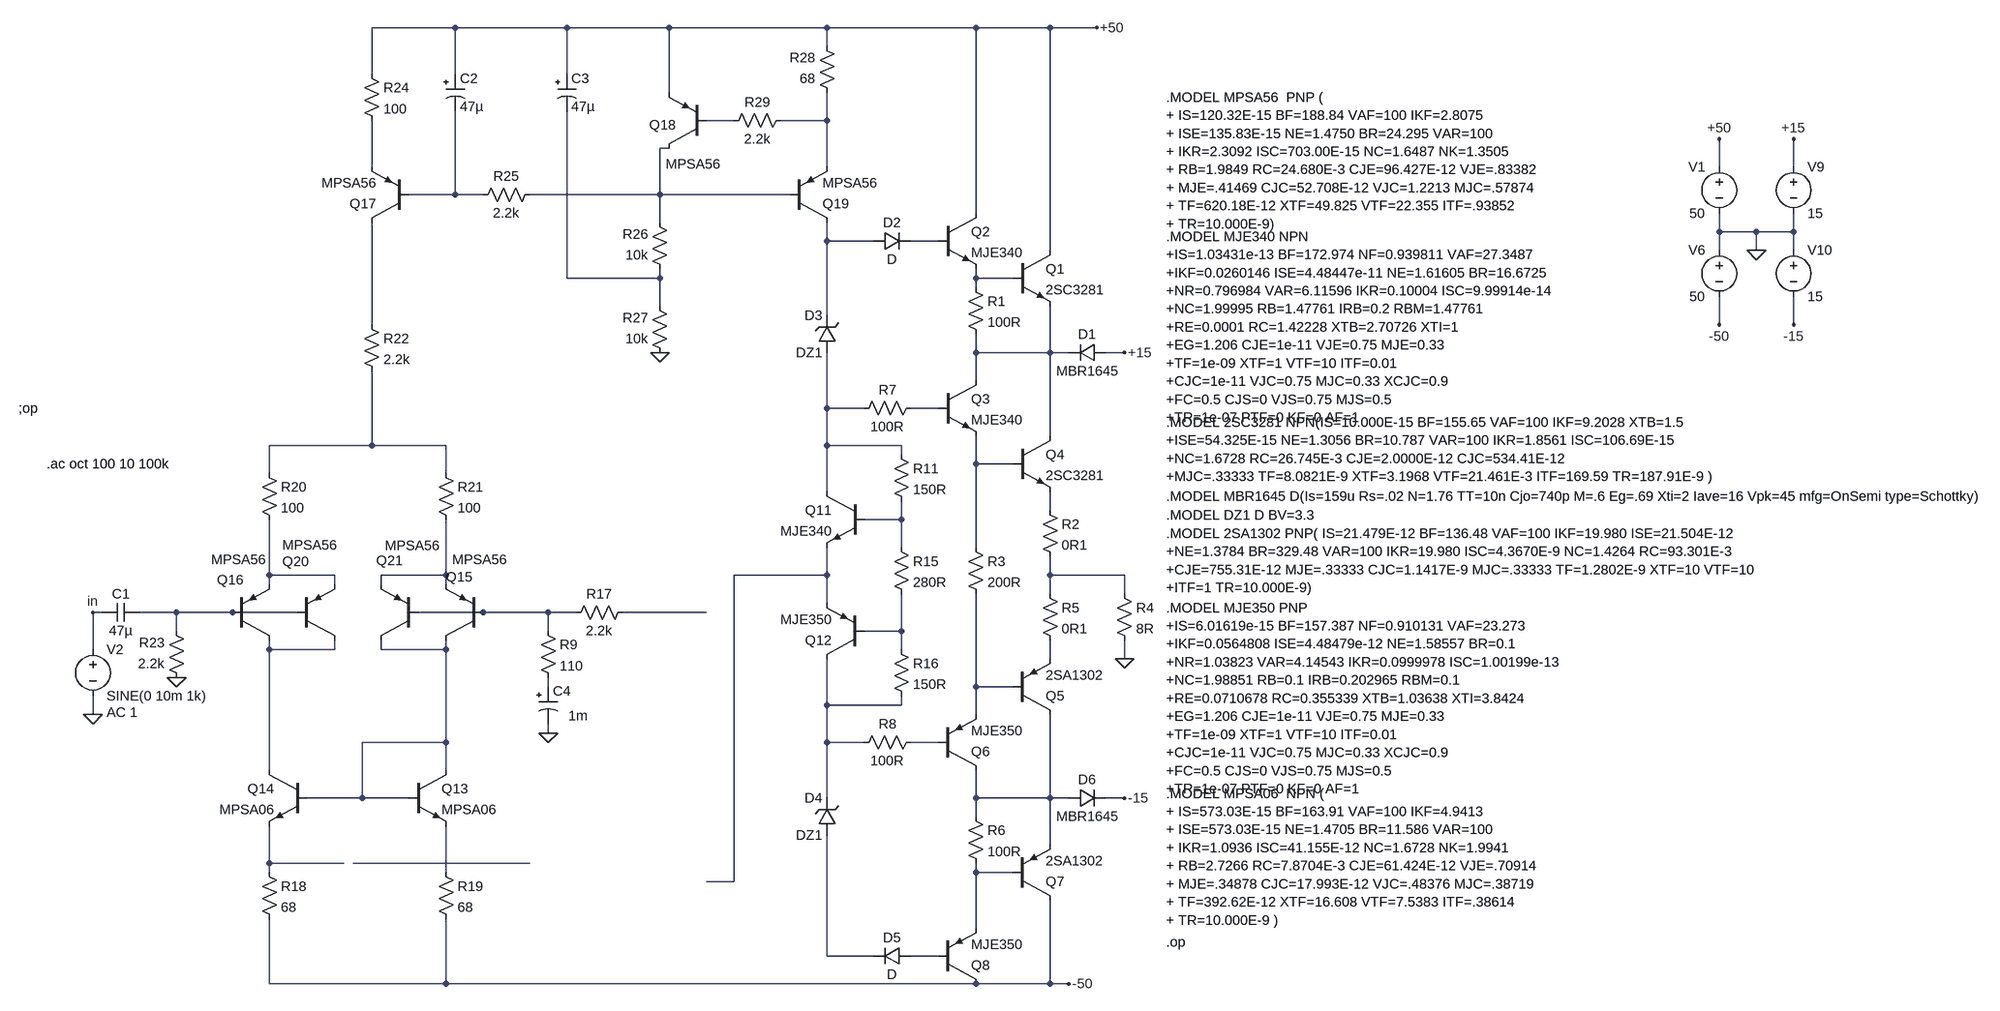
[diagram p0: schematic ampli_g_real.asc]
ampli_g_real.asc, the LTspice schematic file:
Version 4
SHEET 1 2528 2020
WIRE -544 -336 -688 -336
WIRE -352 -336 -544 -336
WIRE -176 -336 -352 -336
WIRE 96 -336 -176 -336
WIRE 352 -336 96 -336
WIRE 480 -336 352 -336
WIRE 560 -336 480 -336
WIRE 96 -304 96 -336
WIRE -688 -256 -688 -336
WIRE -544 -256 -544 -336
WIRE -352 -256 -352 -336
WIRE -176 -224 -176 -336
WIRE -64 -176 -112 -176
WIRE 96 -176 96 -224
WIRE 96 -176 16 -176
WIRE -176 -128 -192 -128
WIRE -688 -96 -688 -176
WIRE 96 -96 96 -176
WIRE 1632 -96 1632 -144
WIRE 1760 -96 1760 -144
WIRE -544 -48 -544 -192
WIRE -544 -48 -624 -48
WIRE -496 -48 -544 -48
WIRE -192 -48 -192 -128
WIRE -192 -48 -416 -48
WIRE 32 -48 -192 -48
WIRE 352 -16 352 -336
WIRE -192 0 -192 -48
WIRE 1632 16 1632 -16
WIRE 1696 16 1632 16
WIRE 1760 16 1760 -16
WIRE 1760 16 1696 16
WIRE 96 32 96 0
WIRE 176 32 96 32
WIRE 288 32 240 32
WIRE 480 48 480 -336
WIRE 1632 48 1632 16
WIRE 1696 48 1696 16
WIRE 1760 48 1760 16
WIRE -352 96 -352 -192
WIRE -192 96 -192 80
WIRE -192 96 -352 96
WIRE 352 96 352 80
WIRE 416 96 352 96
WIRE 352 112 352 96
WIRE -192 144 -192 96
WIRE 96 160 96 32
WIRE -688 176 -688 0
WIRE 1632 176 1632 128
WIRE 1760 176 1760 128
WIRE 352 224 352 192
WIRE 480 224 480 144
WIRE 480 224 352 224
WIRE 512 224 480 224
WIRE 608 224 576 224
WIRE 352 272 352 224
WIRE 96 320 96 224
WIRE 160 320 96 320
WIRE 288 320 240 320
WIRE 480 368 480 224
WIRE -688 384 -688 256
WIRE -688 384 -864 384
WIRE -560 384 -688 384
WIRE 96 384 96 320
WIRE 224 384 96 384
WIRE 224 400 224 384
WIRE 352 416 352 368
WIRE 416 416 352 416
WIRE -864 432 -864 384
WIRE -560 432 -560 384
WIRE 96 464 96 384
WIRE 480 496 480 464
WIRE 224 512 224 480
WIRE 224 512 160 512
WIRE 224 560 224 512
WIRE 352 560 352 416
WIRE -864 608 -864 512
WIRE -752 608 -864 608
WIRE -560 608 -560 512
WIRE -560 608 -672 608
WIRE 96 608 96 560
WIRE 96 608 -64 608
WIRE 480 608 480 576
WIRE 608 608 480 608
WIRE -864 624 -864 608
WIRE -752 624 -752 608
WIRE -672 624 -672 608
WIRE -560 624 -560 608
WIRE 480 640 480 608
WIRE 608 640 608 608
WIRE 96 656 96 608
WIRE -1152 672 -1168 672
WIRE -1024 672 -1088 672
WIRE -928 672 -1024 672
WIRE -816 672 -928 672
WIRE -496 672 -608 672
WIRE -384 672 -496 672
WIRE -336 672 -384 672
WIRE -112 672 -256 672
WIRE -1024 704 -1024 672
WIRE -384 704 -384 672
WIRE 224 704 224 640
WIRE 224 704 160 704
WIRE -1168 736 -1168 672
WIRE -864 736 -864 720
WIRE -752 736 -752 720
WIRE -752 736 -864 736
WIRE -672 736 -672 720
WIRE -560 736 -560 720
WIRE -560 736 -672 736
WIRE 224 736 224 704
WIRE 480 752 480 720
WIRE 608 752 608 720
WIRE -384 800 -384 784
WIRE 352 800 352 640
WIRE 416 800 352 800
WIRE 96 832 96 752
WIRE 224 832 224 816
WIRE 224 832 96 832
WIRE -1168 848 -1168 816
WIRE 352 848 352 800
WIRE -384 880 -384 864
WIRE -560 896 -560 736
WIRE -560 896 -704 896
WIRE 96 896 96 832
WIRE 160 896 96 896
WIRE 288 896 240 896
WIRE -864 944 -864 736
WIRE -560 944 -560 896
WIRE -704 992 -704 896
WIRE -704 992 -800 992
WIRE -624 992 -704 992
WIRE 96 992 96 896
WIRE 352 992 352 944
WIRE 480 992 480 848
WIRE 480 992 352 992
WIRE 512 992 480 992
WIRE 608 992 576 992
WIRE 352 1024 352 992
WIRE 480 1072 480 992
WIRE -864 1104 -864 1040
WIRE -736 1104 -864 1104
WIRE -416 1104 -720 1104
WIRE -864 1120 -864 1104
WIRE -560 1120 -560 1040
WIRE 352 1120 352 1104
WIRE 416 1120 352 1120
WIRE -64 1136 -64 608
WIRE -64 1136 -112 1136
WIRE 352 1216 352 1120
WIRE 96 1264 96 1056
WIRE 176 1264 96 1264
WIRE 288 1264 240 1264
WIRE -864 1312 -864 1200
WIRE -560 1312 -560 1200
WIRE -560 1312 -864 1312
WIRE 352 1312 -560 1312
WIRE 480 1312 480 1168
WIRE 480 1312 352 1312
WIRE 512 1312 480 1312
FLAG 608 752 0
FLAG 1632 -144 +50
FLAG 1632 176 -50
FLAG 1760 -144 +15
FLAG 1760 176 -15
FLAG 1696 48 0
FLAG 512 1312 -50
FLAG 608 992 -15
FLAG 560 -336 +50
FLAG 608 224 +15
FLAG -1168 848 0
FLAG -1024 784 0
FLAG -1168 672 in
FLAG -192 224 0
FLAG -384 880 0
DATAFLAG -736 1104 ""
SYMBOL npn 416 48 R0
SYMATTR InstName Q1
SYMATTR Value 2SC3281
SYMBOL npn 288 -16 R0
SYMATTR InstName Q2
SYMATTR Value MJE340
SYMBOL res 336 96 R0
SYMATTR InstName R1
SYMATTR Value 100R
SYMBOL diode 576 208 R90
WINDOW 0 0 32 VBottom 2
WINDOW 3 32 32 VTop 2
SYMATTR InstName D1
SYMATTR Value MBR1645
SYMBOL diode 176 48 R270
WINDOW 0 32 32 VTop 2
WINDOW 3 0 32 VBottom 2
SYMATTR InstName D2
SYMBOL zener 112 224 R180
WINDOW 0 24 64 Left 2
WINDOW 3 24 0 Left 2
SYMATTR InstName D3
SYMATTR Value DZ1
SYMBOL npn 288 272 R0
SYMATTR InstName Q3
SYMATTR Value MJE340
SYMBOL npn 416 368 R0
SYMATTR InstName Q4
SYMATTR Value 2SC3281
SYMBOL res 464 480 R0
SYMATTR InstName R2
SYMATTR Value 0R1
SYMBOL res 336 544 R0
SYMATTR InstName R3
SYMATTR Value 200R
SYMBOL res 592 624 R0
SYMATTR InstName R4
SYMATTR Value 8R
SYMBOL res 464 624 R0
SYMATTR InstName R5
SYMATTR Value 0R1
SYMBOL pnp 416 848 M180
SYMATTR InstName Q5
SYMATTR Value 2SA1302
SYMBOL pnp 288 944 M180
SYMATTR InstName Q6
SYMATTR Value MJE350
SYMBOL pnp 416 1168 M180
SYMATTR InstName Q7
SYMATTR Value 2SA1302
SYMBOL pnp 288 1312 M180
SYMATTR InstName Q8
SYMATTR Value MJE350
SYMBOL res 336 1008 R0
SYMATTR InstName R6
SYMATTR Value 100R
SYMBOL zener 112 1056 R180
WINDOW 0 24 64 Left 2
WINDOW 3 24 0 Left 2
SYMATTR InstName D4
SYMATTR Value DZ1
SYMBOL diode 240 1248 R90
WINDOW 0 0 32 VBottom 2
WINDOW 3 32 32 VTop 2
SYMATTR InstName D5
SYMBOL diode 512 1008 R270
WINDOW 0 32 32 VTop 2
WINDOW 3 0 32 VBottom 2
SYMATTR InstName D6
SYMATTR Value MBR1645
SYMBOL res 256 304 R90
WINDOW 0 0 56 VBottom 2
WINDOW 3 32 56 VTop 2
SYMATTR InstName R7
SYMATTR Value 100R
SYMBOL res 256 880 R90
WINDOW 0 0 56 VBottom 2
WINDOW 3 32 56 VTop 2
SYMATTR InstName R8
SYMATTR Value 100R
SYMBOL npn 160 464 M0
SYMATTR InstName Q11
SYMATTR Value MJE340
SYMBOL pnp 160 752 R180
SYMATTR InstName Q12
SYMATTR Value MJE350
SYMBOL res 208 384 R0
SYMATTR InstName R11
SYMATTR Value 150R
SYMBOL res 208 544 R0
SYMATTR InstName R15
SYMATTR Value 280R
SYMBOL res 208 720 R0
SYMATTR InstName R16
SYMATTR Value 150R
SYMBOL voltage 1632 -112 M0
SYMATTR InstName V1
SYMATTR Value 50
SYMBOL voltage 1632 32 M0
SYMATTR InstName V6
SYMATTR Value 50
SYMBOL voltage 1760 -112 R0
SYMATTR InstName V9
SYMATTR Value 15
SYMBOL voltage 1760 32 R0
SYMATTR InstName V10
SYMATTR Value 15
SYMBOL npn -624 944 R0
SYMATTR InstName Q13
SYMATTR Value MPSA06
SYMBOL npn -800 944 M0
SYMATTR InstName Q14
SYMATTR Value MPSA06
SYMBOL res -240 656 R90
WINDOW 0 0 56 VBottom 2
WINDOW 3 32 56 VTop 2
SYMATTR InstName R17
SYMATTR Value 2.2k
SYMBOL res -880 1104 R0
SYMATTR InstName R18
SYMATTR Value 68
SYMBOL res -576 1104 R0
SYMATTR InstName R19
SYMATTR Value 68
SYMBOL res -880 416 R0
SYMATTR InstName R20
SYMATTR Value 100
SYMBOL res -576 416 R0
SYMATTR InstName R21
SYMATTR Value 100
SYMBOL voltage -1168 720 R0
WINDOW 123 24 124 Left 2
WINDOW 39 0 0 Left 2
SYMATTR Value2 AC 1
SYMATTR InstName V2
SYMATTR Value SINE(0 10m 1k)
SYMBOL res -704 160 R0
SYMATTR InstName R22
SYMATTR Value 2.2k
SYMBOL res -1008 800 R180
WINDOW 0 36 76 Left 2
WINDOW 3 36 40 Left 2
SYMATTR InstName R23
SYMATTR Value 2.2k
SYMBOL pnp -496 720 R180
WINDOW 0 18 109 Left 2
WINDOW 3 -41 139 Left 2
SYMATTR InstName Q15
SYMATTR Value MPSA56
SYMBOL pnp -928 720 M180
WINDOW 0 -26 104 Left 2
WINDOW 3 -36 139 Left 2
SYMATTR InstName Q16
SYMATTR Value MPSA56
SYMBOL cap -1088 656 R90
WINDOW 0 0 32 VBottom 2
WINDOW 3 32 32 VTop 2
SYMATTR InstName C1
SYMATTR Value 47µ
SYMBOL pnp -624 0 R180
SYMATTR InstName Q17
SYMATTR Value MPSA56
SYMBOL pnp -112 -128 R180
WINDOW 0 52 40 Left 2
WINDOW 3 -25 -27 Left 2
SYMATTR InstName Q18
SYMATTR Value MPSA56
SYMBOL pnp 32 0 M180
SYMATTR InstName Q19
SYMATTR Value MPSA56
SYMBOL res -704 -272 R0
SYMATTR InstName R24
SYMATTR Value 100
SYMBOL res -400 -64 R90
WINDOW 0 0 56 VBottom 2
WINDOW 3 32 56 VTop 2
SYMATTR InstName R25
SYMATTR Value 2.2k
SYMBOL res -176 96 R180
WINDOW 0 36 76 Left 2
WINDOW 3 36 40 Left 2
SYMATTR InstName R26
SYMATTR Value 10k
SYMBOL res -176 240 R180
WINDOW 0 36 76 Left 2
WINDOW 3 36 40 Left 2
SYMATTR InstName R27
SYMATTR Value 10k
SYMBOL res 112 -208 R180
WINDOW 0 36 76 Left 2
WINDOW 3 36 40 Left 2
SYMATTR InstName R28
SYMATTR Value 68
SYMBOL res -80 -160 R270
WINDOW 0 32 56 VTop 2
WINDOW 3 0 56 VBottom 2
SYMATTR InstName R29
SYMATTR Value 2.2k
SYMBOL polcap -560 -256 R0
SYMATTR InstName C2
SYMATTR Value 47µ
SYMATTR SpiceLine V=25
SYMBOL polcap -368 -256 R0
SYMATTR InstName C3
SYMATTR Value 47µ
SYMATTR SpiceLine V=25
SYMBOL pnp -816 720 M180
WINDOW 0 -26 136 Left 2
WINDOW 3 -26 164 Left 2
SYMATTR InstName Q20
SYMATTR Value MPSA56
SYMBOL pnp -608 720 R180
WINDOW 0 26 137 Left 2
WINDOW 3 -37 163 Left 2
SYMATTR InstName Q21
SYMATTR Value MPSA56
SYMBOL res -400 688 R0
SYMATTR InstName R9
SYMATTR Value 110
SYMBOL polcap -400 800 R0
WINDOW 3 51 50 Left 2
SYMATTR InstName C4
SYMATTR Value 1m
SYMATTR SpiceLine V=25
TEXT 680 1240 Left 2 !.op
TEXT 680 504 Left 2 !.MODEL DZ1 D BV=3.3
TEXT 680 -216 Left 2 !.MODEL MPSA56  PNP (\n+ IS=120.32E-15 BF=188.84 VAF=100 IKF=2.8075\n+ ISE=135.83E-15 NE=1.4750 BR=24.295 VAR=100\n+ IKR=2.3092 ISC=703.00E-15 NC=1.6487 NK=1.3505\n+ RB=1.9849 RC=24.680E-3 CJE=96.427E-12 VJE=.83382\n+ MJE=.41469 CJC=52.708E-12 VJC=1.2213 MJC=.57874\n+ TF=620.18E-12 XTF=49.825 VTF=22.355 ITF=.93852\n+ TR=10.000E-9)
TEXT 680 24 Left 2 !.MODEL MJE340 NPN\n+IS=1.03431e-13 BF=172.974 NF=0.939811 VAF=27.3487\n+IKF=0.0260146 ISE=4.48447e-11 NE=1.61605 BR=16.6725\n+NR=0.796984 VAR=6.11596 IKR=0.10004 ISC=9.99914e-14\n+NC=1.99995 RB=1.47761 IRB=0.2 RBM=1.47761\n+RE=0.0001 RC=1.42228 XTB=2.70726 XTI=1\n+EG=1.206 CJE=1e-11 VJE=0.75 MJE=0.33\n+TF=1e-09 XTF=1 VTF=10 ITF=0.01\n+CJC=1e-11 VJC=0.75 MJC=0.33 XCJC=0.9\n+FC=0.5 CJS=0 VJS=0.75 MJS=0.5\n+TR=1e-07 PTF=0 KF=0 AF=1
TEXT 680 344 Left 2 !.MODEL 2SC3281 NPN(IS=10.000E-15 BF=155.65 VAF=100 IKF=9.2028 XTB=1.5\n+ISE=54.325E-15 NE=1.3056 BR=10.787 VAR=100 IKR=1.8561 ISC=106.69E-15\n+NC=1.6728 RC=26.745E-3 CJE=2.0000E-12 CJC=534.41E-12\n+MJC=.33333 TF=8.0821E-9 XTF=3.1968 VTF=21.461E-3 ITF=169.59 TR=187.91E-9 )
TEXT 680 472 Left 2 !.MODEL MBR1645 D(Is=159u Rs=.02 N=1.76 TT=10n Cjo=740p M=.6 Eg=.69 Xti=2 Iave=16 Vpk=45 mfg=OnSemi type=Schottky)
TEXT 680 536 Left 2 !.MODEL 2SA1302 PNP( IS=21.479E-12 BF=136.48 VAF=100 IKF=19.980 ISE=21.504E-12\n+NE=1.3784 BR=329.48 VAR=100 IKR=19.980 ISC=4.3670E-9 NC=1.4264 RC=93.301E-3\n+CJE=755.31E-12 MJE=.33333 CJC=1.1417E-9 MJC=.33333 TF=1.2802E-9 XTF=10 VTF=10\n+ITF=1 TR=10.000E-9)
TEXT 680 664 Left 2 !.MODEL MJE350 PNP\n+IS=6.01619e-15 BF=157.387 NF=0.910131 VAF=23.273\n+IKF=0.0564808 ISE=4.48479e-12 NE=1.58557 BR=0.1\n+NR=1.03823 VAR=4.14543 IKR=0.0999978 ISC=1.00199e-13\n+NC=1.98851 RB=0.1 IRB=0.202965 RBM=0.1\n+RE=0.0710678 RC=0.355339 XTB=1.03638 XTI=3.8424\n+EG=1.206 CJE=1e-11 VJE=0.75 MJE=0.33\n+TF=1e-09 XTF=1 VTF=10 ITF=0.01\n+CJC=1e-11 VJC=0.75 MJC=0.33 XCJC=0.9\n+FC=0.5 CJS=0 VJS=0.75 MJS=0.5\n+TR=1e-07 PTF=0 KF=0 AF=1
TEXT 680 984 Left 2 !.MODEL MPSA06  NPN (\n+ IS=573.03E-15 BF=163.91 VAF=100 IKF=4.9413\n+ ISE=573.03E-15 NE=1.4705 BR=11.586 VAR=100\n+ IKR=1.0936 ISC=41.155E-12 NC=1.6728 NK=1.9941\n+ RB=2.7266 RC=7.8704E-3 CJE=61.424E-12 VJE=.70914\n+ MJE=.34878 CJC=17.993E-12 VJC=.48376 MJC=.38719\n+ TF=392.62E-12 XTF=16.608 VTF=7.5383 ITF=.38614\n+ TR=10.000E-9 )
TEXT -1296 320 Left 2 !;op
TEXT -1248 416 Left 2 !.ac oct 100 10 100k

The netlist it stands for:
* ampli_g_real.asc
Q1 +50 N009 N011 0 2SC3281
Q2 +50 N007 N009 0 MJE340
R1 N009 N011 100R
D1 +15 N011 MBR1645
D2 N006 N007 D
D3 N012 N006 DZ1
Q3 N011 N013 N015 0 MJE340
Q4 N011 N015 N016 0 2SC3281
R2 N016 N021 0R1
R3 N015 N030 200R
R4 N021 0 8R
R5 N021 N028 0R1
Q5 N033 N030 N028 0 2SA1302
Q6 N033 N032 N030 0 MJE350
Q7 -50 N037 N033 0 2SA1302
Q8 -50 N039 N037 0 MJE350
R6 N033 N037 100R
D4 N038 N031 DZ1
D5 N039 N038 D
D6 N033 -15 MBR1645
R7 N013 N012 100R
R8 N032 N031 100R
Q11 N012 N017 N020 0 MJE340
Q12 N031 N025 N020 0 MJE350
R11 N012 N017 150R
R15 N017 N025 280R
R16 N025 N031 150R
V1 +50 0 50
V6 0 -50 50
V9 +15 0 15
V10 0 -15 15
Q13 N027 N027 N036 0 MPSA06
Q14 N026 N027 N034 0 MPSA06
R17 N024 N023 2.2k
R18 N034 -50 68
R19 N036 -50 68
R20 N014 N018 100
R21 N014 N019 100
V2 in 0 SINE(0 10m 1k) AC 1
R22 N010 N014 2.2k
R23 0 N022 2.2k
Q15 N027 N023 N019 0 MPSA56
Q16 N026 N022 N018 0 MPSA56
C1 N022 in 47µ
Q17 N010 N005 N004 0 MPSA56
Q18 N003 N001 +50 0 MPSA56
Q19 N006 N003 N002 0 MPSA56
R24 +50 N004 100
R25 N003 N005 2.2k
R26 N008 N003 10k
R27 0 N008 10k
R28 N002 +50 68
R29 N001 N002 2.2k
C2 +50 N005 47µ V=25
C3 +50 N008 47µ V=25
Q20 N026 N022 N018 0 MPSA56
Q21 N027 N023 N019 0 MPSA56
R9 N023 N029 110
C4 N029 0 1m V=25
.model D D
.lib standard.dio
.model NPN NPN
.model PNP PNP
.lib standard.bjt
.op
.MODEL DZ1 D BV=3.3
.MODEL MPSA56  PNP (
+ IS=120.32E-15 BF=188.84 VAF=100 IKF=2.8075
+ ISE=135.83E-15 NE=1.4750 BR=24.295 VAR=100
+ IKR=2.3092 ISC=703.00E-15 NC=1.6487 NK=1.3505
+ RB=1.9849 RC=24.680E-3 CJE=96.427E-12 VJE=.83382
+ MJE=.41469 CJC=52.708E-12 VJC=1.2213 MJC=.57874
+ TF=620.18E-12 XTF=49.825 VTF=22.355 ITF=.93852
+ TR=10.000E-9)
.MODEL MJE340 NPN
+IS=1.03431e-13 BF=172.974 NF=0.939811 VAF=27.3487
+IKF=0.0260146 ISE=4.48447e-11 NE=1.61605 BR=16.6725
+NR=0.796984 VAR=6.11596 IKR=0.10004 ISC=9.99914e-14
+NC=1.99995 RB=1.47761 IRB=0.2 RBM=1.47761
+RE=0.0001 RC=1.42228 XTB=2.70726 XTI=1
+EG=1.206 CJE=1e-11 VJE=0.75 MJE=0.33
+TF=1e-09 XTF=1 VTF=10 ITF=0.01
+CJC=1e-11 VJC=0.75 MJC=0.33 XCJC=0.9
+FC=0.5 CJS=0 VJS=0.75 MJS=0.5
+TR=1e-07 PTF=0 KF=0 AF=1
.MODEL 2SC3281 NPN(IS=10.000E-15 BF=155.65 VAF=100 IKF=9.2028 XTB=1.5
+ISE=54.325E-15 NE=1.3056 BR=10.787 VAR=100 IKR=1.8561 ISC=106.69E-15
+NC=1.6728 RC=26.745E-3 CJE=2.0000E-12 CJC=534.41E-12
+MJC=.33333 TF=8.0821E-9 XTF=3.1968 VTF=21.461E-3 ITF=169.59 TR=187.91E-9 )
.MODEL MBR1645 D(Is=159u Rs=.02 N=1.76 TT=10n Cjo=740p M=.6 Eg=.69 Xti=2 Iave=16 Vpk=45 mfg=OnSemi type=Schottky)
.MODEL 2SA1302 PNP( IS=21.479E-12 BF=136.48 VAF=100 IKF=19.980 ISE=21.504E-12
+NE=1.3784 BR=329.48 VAR=100 IKR=19.980 ISC=4.3670E-9 NC=1.4264 RC=93.301E-3
+CJE=755.31E-12 MJE=.33333 CJC=1.1417E-9 MJC=.33333 TF=1.2802E-9 XTF=10 VTF=10
+ITF=1 TR=10.000E-9)
.MODEL MJE350 PNP
+IS=6.01619e-15 BF=157.387 NF=0.910131 VAF=23.273
+IKF=0.0564808 ISE=4.48479e-12 NE=1.58557 BR=0.1
+NR=1.03823 VAR=4.14543 IKR=0.0999978 ISC=1.00199e-13
+NC=1.98851 RB=0.1 IRB=0.202965 RBM=0.1
+RE=0.0710678 RC=0.355339 XTB=1.03638 XTI=3.8424
+EG=1.206 CJE=1e-11 VJE=0.75 MJE=0.33
+TF=1e-09 XTF=1 VTF=10 ITF=0.01
+CJC=1e-11 VJC=0.75 MJC=0.33 XCJC=0.9
+FC=0.5 CJS=0 VJS=0.75 MJS=0.5
+TR=1e-07 PTF=0 KF=0 AF=1
.MODEL MPSA06  NPN (
+ IS=573.03E-15 BF=163.91 VAF=100 IKF=4.9413
+ ISE=573.03E-15 NE=1.4705 BR=11.586 VAR=100
+ IKR=1.0936 ISC=41.155E-12 NC=1.6728 NK=1.9941
+ RB=2.7266 RC=7.8704E-3 CJE=61.424E-12 VJE=.70914
+ MJE=.34878 CJC=17.993E-12 VJC=.48376 MJC=.38719
+ TF=392.62E-12 XTF=16.608 VTF=7.5383 ITF=.38614
+ TR=10.000E-9 )
;op
.ac oct 100 10 100k
.backanno
.end